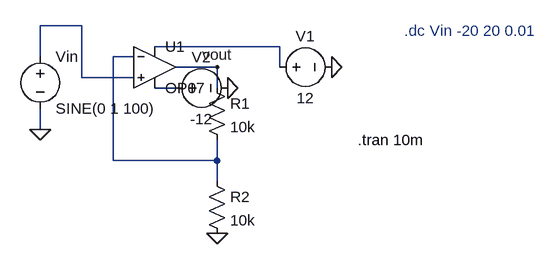
[diagram p0: schematic dcsine2.asc]
dcsine2.asc, the LTspice schematic file:
Version 4
SHEET 1 1092 680
WIRE 336 256 272 256
WIRE 640 288 448 288
WIRE 272 304 272 256
WIRE 416 304 384 304
WIRE 544 320 480 320
WIRE 640 320 640 288
WIRE 336 336 336 256
WIRE 416 336 336 336
WIRE 480 352 448 352
WIRE 544 352 544 320
WIRE 272 416 272 384
WIRE 384 464 384 304
WIRE 544 464 544 432
WIRE 544 464 384 464
WIRE 544 496 544 464
FLAG 544 576 0
FLAG 272 416 0
FLAG 720 320 0
FLAG 560 352 0
FLAG 544 320 vout
SYMBOL voltage 272 288 R0
SYMATTR InstName Vin
SYMATTR Value SINE(0 1 100)
SYMBOL res 528 336 R0
SYMATTR InstName R1
SYMATTR Value 10k
SYMBOL res 528 480 R0
SYMATTR InstName R2
SYMATTR Value 10k
SYMBOL voltage 624 320 R270
WINDOW 0 32 56 VTop 2
WINDOW 3 -32 56 VBottom 2
SYMATTR InstName V1
SYMATTR Value 12
SYMBOL voltage 464 352 R270
WINDOW 0 32 56 VTop 2
WINDOW 3 -32 56 VBottom 2
SYMATTR InstName V2
SYMATTR Value -12
SYMBOL OpAmps/OP07 448 256 R0
SYMATTR InstName U1
TEXT 832 264 Left 2 ;.dc Vin -20 20 0.01
TEXT 760 432 Left 2 !.tran 10m

The netlist it stands for:
* dcsine2.asc
Vin N001 0 SINE(0 1 100)
R1 vout N003 10k
R2 N003 0 10k
V1 N002 0 12
V2 N004 0 -12
XU1 N001 N003 N002 N004 vout LT1001  ; OP07, pins In+ In- V+ V- OUT
* .dc Vin -20 20 0.01
.tran 10m
.lib LTC.lib
.backanno
.end